# Altium schematic sheet PCIe_x4.SchDoc
size A4
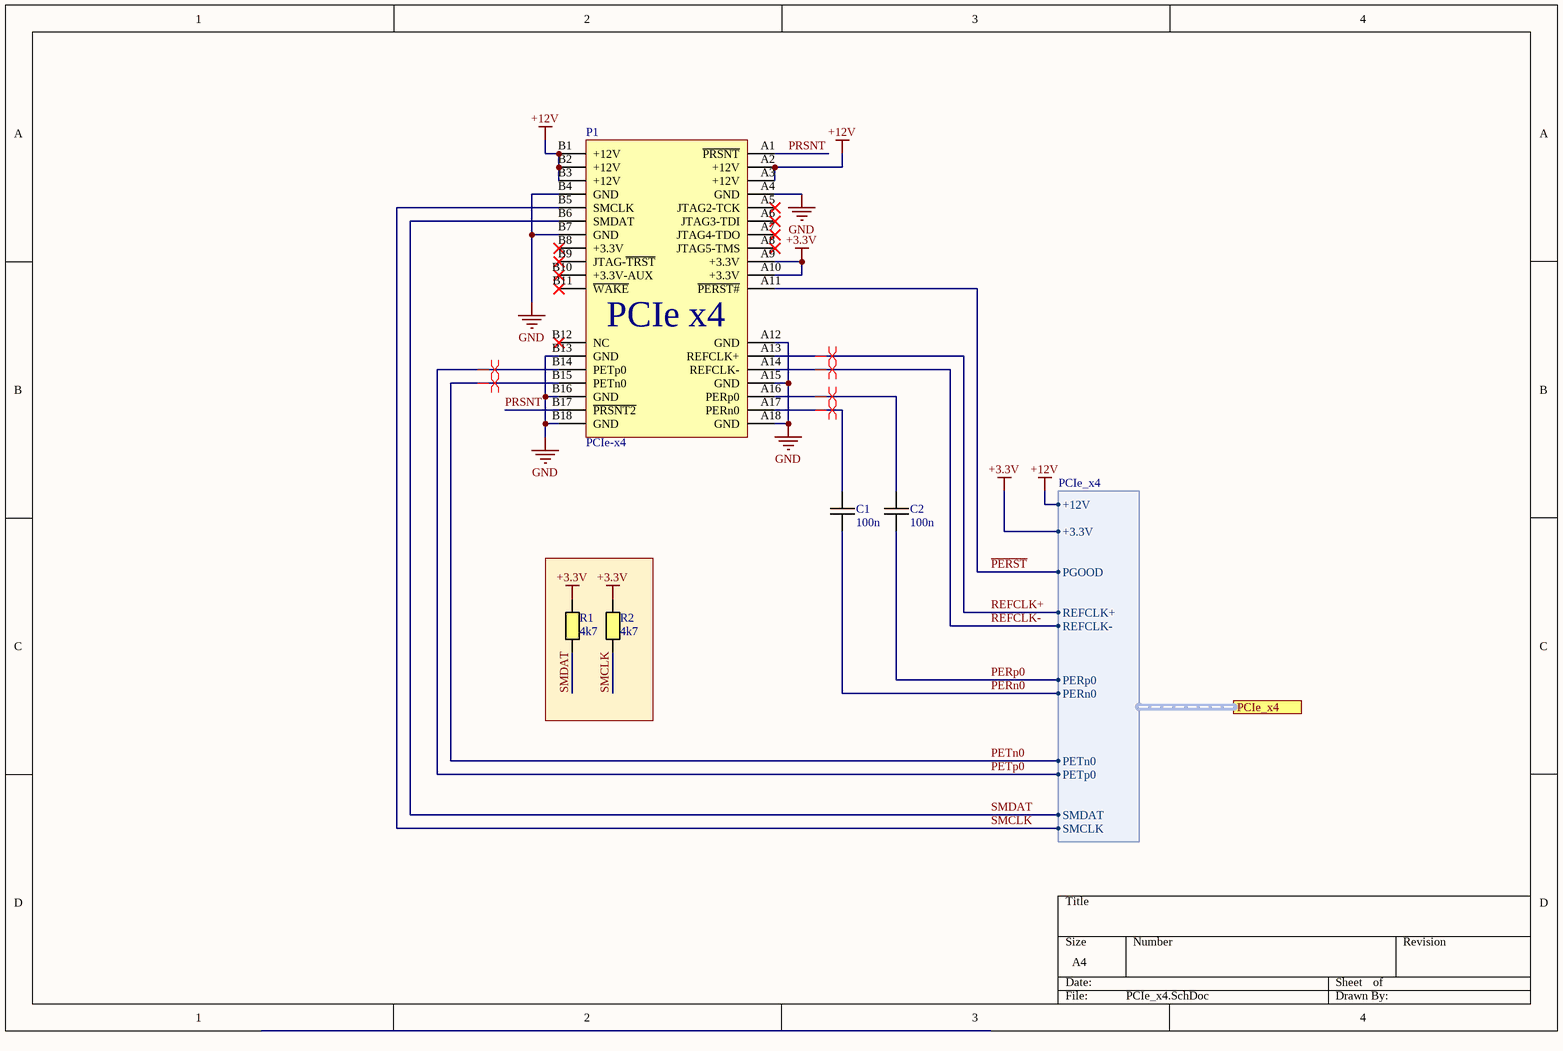
[diagram p0: PCIe_x4.SchDoc]

## Parts
C1  100n  [CAPC0603(1608)55_M]
C2  100n  [CAPC0603(1608)55_M]
P1  PCIe-x4  [PCIe x4 edge connector]
R1  4k7  [RESC1210(3225)_N]
R2  4k7  [RESC1210(3225)_N]

## Ports
PCIe_x4 (harness PCIe_x4)

## Harnesses
PCIe_x4: PGOOD, REFCLK+, REFCLK-, PETp0, PETn0, PERp0, PERn0, SMCLK, SMDAT, +3.3V, +12V

## Nets
+3.3V: P1.A9(+3.3V) P1.A10(+3.3V) R1.2 R2.2 ; port PCIe_x4.+3.3V
+12V: P1.A2(+12V) P1.A3(+12V) P1.B1(+12V) P1.B2(+12V) P1.B3(+12V) ; port PCIe_x4.+12V
GND: P1.A4(GND) P1.A12(GND) P1.A15(GND) P1.A18(GND) P1.B4(GND) P1.B7(GND) P1.B13(GND) P1.B16(GND) P1.B18(GND)
~{PERST}: P1.A11(~{PERST#}) ; port PCIe_x4.PGOOD
PERn0: C1.2 ; port PCIe_x4.PERn0
PERp0: C2.2 ; port PCIe_x4.PERp0
PETn0: P1.B15(PETn0) ; port PCIe_x4.PETn0
PETp0: P1.B14(PETp0) ; port PCIe_x4.PETp0
PRSNT: P1.A1(~{PRSNT}) P1.B17(~{PRSNT2})
REFCLK+: P1.A13(REFCLK+) ; port PCIe_x4.REFCLK+
REFCLK-: P1.A14(REFCLK-) ; port PCIe_x4.REFCLK-
SMCLK: P1.B5(SMCLK) R2.1 ; port PCIe_x4.SMCLK
SMDAT: P1.B6(SMDAT) R1.1 ; port PCIe_x4.SMDAT
NetC1_1: C1.1 P1.A17(PERn0)
NetC2_1: C2.1 P1.A16(PERp0)

Not connected (* = marked no-connect by the designer): P1 A5(JTAG2-TCK)* A6(JTAG3-TDI)* A7(JTAG4-TDO)* A8(JTAG5-TMS)* B8(+3.3V)* B9(JTAG-~{TRST})* B10(+3.3V-AUX)* B11(~{WAKE})* B12(NC)*

## Layout directives
differential pair: NetC1_1, NetC2_1, PETn0, PETp0, REFCLK+, REFCLK-

## Library data of the parts
C1 C2 = Capacitor L: Ceramic capacitor Low density; Value: 100n
P1 = PCIe x4
R1 R2 = Resistor M: Resistor Medium Density; Value: 4k7